# EAGLE design power1pDINline4 (EAGLE 9.3.1)
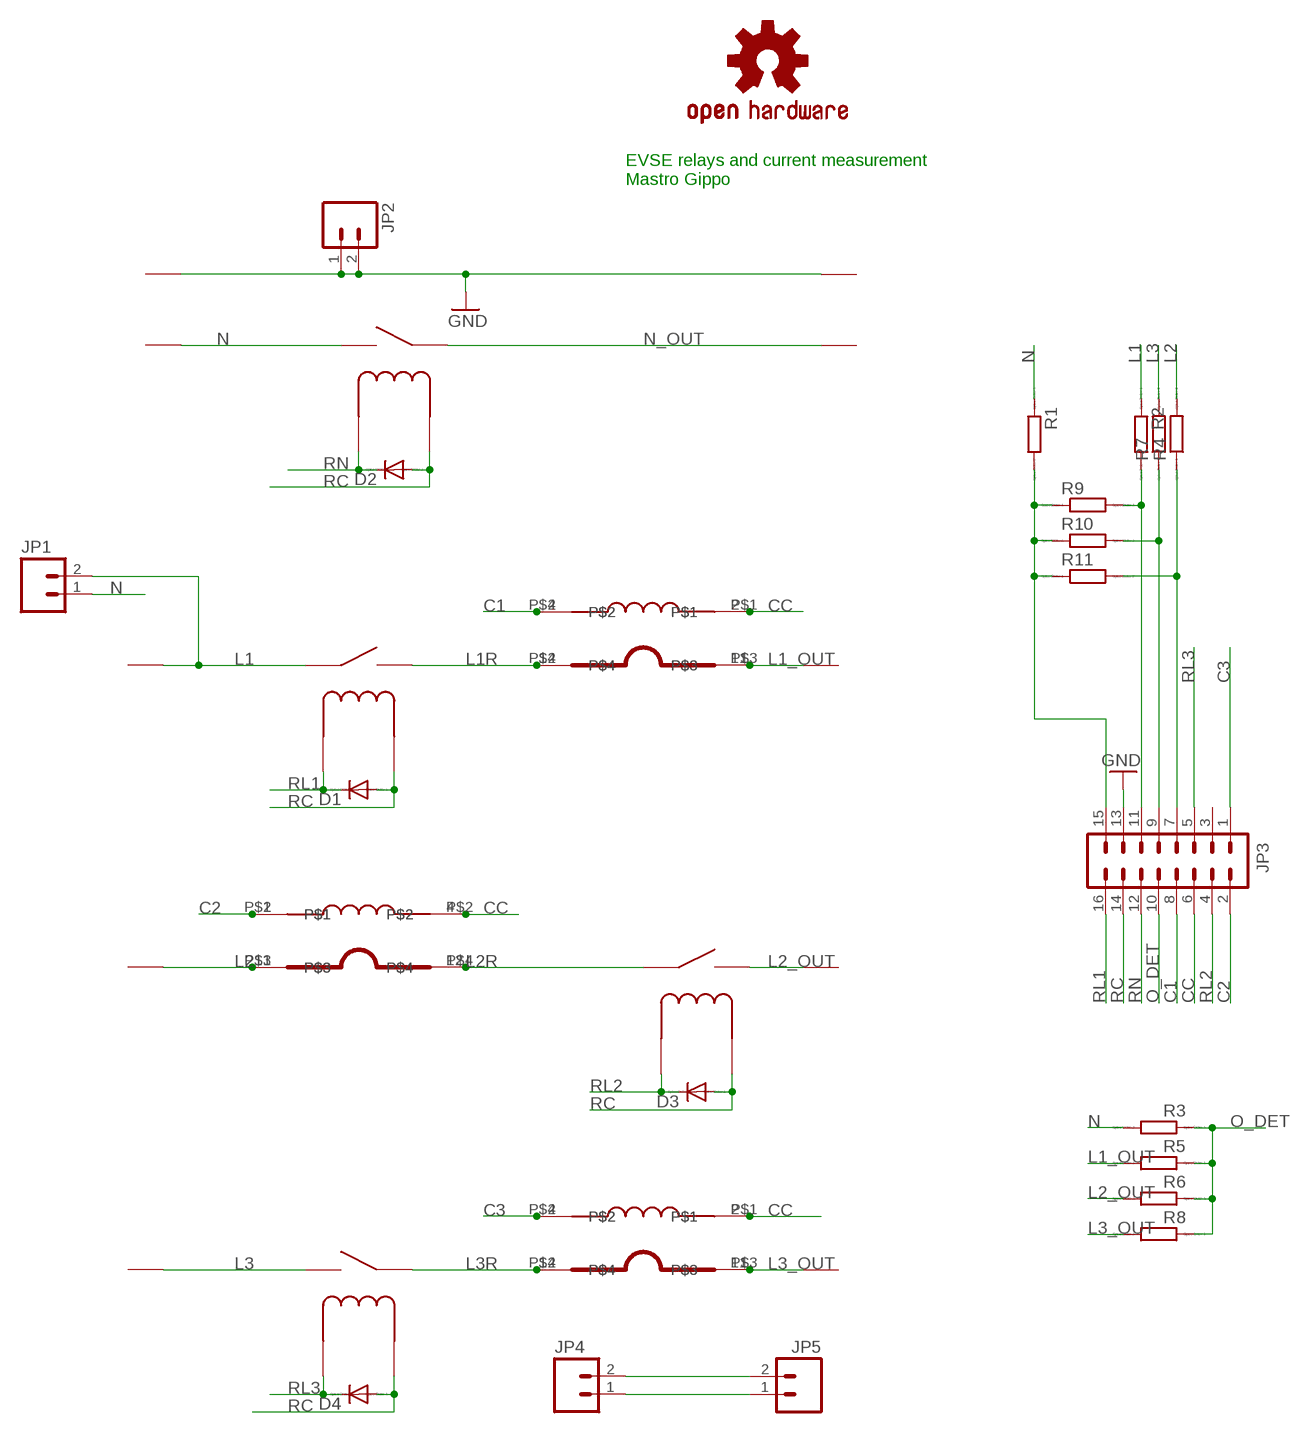
[diagram p0: schematic, sheet 1]

## Parts
D1  DIODE-DO-214AC  [DO-214AC]
D2  DIODE-DO-214AC  [DO-214AC]
D3  DIODE-DO-214AC  [DO-214AC]
D4  DIODE-DO-214AC  [DO-214AC]
JP1  M025MM  [SCREWTERMINAL-5MM-2]
JP2  M025MM  [SCREWTERMINAL-5MM-2]
JP3  M08X2  [2X8]
JP4  M025MM  [SCREWTERMINAL-5MM-2]
JP5  M025MM  [SCREWTERMINAL-5MM-2]
R1  R-EU_0207_10  [0207/10]
R2  R-EU_0207_10  [0207/10]
R3  R-EU_0207_10  [0207/10]
R4  R-EU_0207_10  [0207/10]
R5  R-EU_0207_10  [0207/10]
R6  R-EU_0207_10  [0207/10]
R7  R-EU_0207_10  [0207/10]
R8  R-EU_0207_10  [0207/10]
R9  R-EU_M0805  [M0805]
R10  R-EU_M0805  [M0805]
R11  R-EU_M0805  [M0805]
U$1  T9S  [T9SSOLAR]
U$2  T9S  [T9SSOLAR]
U$3  PLH5_1  [PLH5]
U$4  PLH5_1  [PLH5]
U$5  PLH5_1  [PLH5]
U$6  PLH5_1  [PLH5]
U$7  PLH5_1  [PLH5]
U$8  CSE187L  [CSE187L]
U$9  PLH5_1  [PLH5]
U$10  PLH5_1  [PLH5]
U$11  PLH5_1  [PLH5]
U$12  T9S  [T9SSOLAR]
U$14  PLH5_1  [PLH5]
U$15  PLH5_1  [PLH5]
U$16  PB0025NL  [PILSA_CURR_MIN]
U$17  T9S  [T9SSOLAR]
U$18  PB0025NL  [PILSA_CURR_MIN]
U$19  PB0025NL  [PILSA_CURR_MIN]
U$20  CSE187L  [CSE187L]
U$21  OSHW-LOGOL  [OSHW-LOGO-L]
U$22  CSE187L  [CSE187L]

## Nets
C1: JP3.8 U$8.P$2 U$18.4
C2: JP3.2 U$19.2 U$22.P$1
C3: JP3.1 U$16.4 U$20.P$2
CC: JP3.6 U$8.P$1 U$16.2 U$18.2 U$19.4 U$20.P$1 U$22.P$2
GND: JP2.1 JP2.2 JP3.13 U$9.P$1 U$9.P$2 U$10.P$1 U$10.P$2
L1: JP1.2 R2.1 U$2.TR1(TR) U$2.TR2(TR) U$4.P$1 U$4.P$2
L1_OUT: R5.2 U$6.P$1 U$6.P$2 U$8.P$3 U$18.11
L1R: U$2.TL1(TL) U$2.TL2(TL) U$8.P$4 U$18.12
L2: R4.2 U$7.P$1 U$7.P$2 U$19.11 U$22.P$3
L2_OUT: R6.2 U$11.P$1 U$11.P$2 U$12.TL1(TL) U$12.TL2(TL)
L2R: U$12.TR1(TR) U$12.TR2(TR) U$19.12 U$22.P$4
L3: R7.2 U$14.P$1 U$14.P$2 U$17.TL1(TL) U$17.TL2(TL)
L3_OUT: R8.2 U$15.P$1 U$15.P$2 U$16.11 U$20.P$3
L3R: U$16.12 U$17.TR1(TR) U$17.TR2(TR) U$20.P$4
N: JP1.1 R1.1 R3.2 U$1.TL1(TL) U$1.TL2(TL) U$3.P$1 U$3.P$2
N$2: JP3.9 R7.1 R10.2
N$4: JP4.1 JP5.1
N$5: JP4.2 JP5.2
N$6: JP3.11 R2.2 R9.2
N$8: JP3.15 R1.2 R9.1 R10.1 R11.1
N$13: JP3.7 R4.1 R11.2
N_OUT: U$1.TR1(TR) U$1.TR2(TR) U$5.P$1 U$5.P$2
O_DET: JP3.10 R3.1 R5.1 R6.1 R8.1
RC: D1.A D2.A D3.A D4.A JP3.14 U$1.C2 U$2.C1 U$12.C1 U$17.C2
RL1: D1.C JP3.16 U$2.C2
RL2: D3.C JP3.4 U$12.C2
RL3: D4.C JP3.5 U$17.C1
RN: D2.C JP3.12 U$1.C1
Unconnected: JP3.3

## Notes on the sheet
- EVSE relays and current measurement
  Mastro Gippo

## Library data of the parts
D1-D4 = diode:DIODE-: DIODE
JP1 JP2 JP4 JP5 = SparkFun-Connectors:M02: Standard 2-pin 0.1" header. Use with - straight break away headers ( PRT-00116) - right angle break away headers (PRT-00553) - swiss pins (PRT-00743) - machine pins (PRT-00117) - female headers (PRT-00115) Molex polarized connector foot print use with: PRT-08233 with associated crimp pins and housings. 2.54_SCREWTERM for use with PRT-10571. 3.5mm Screw Terminal footprints for PRT-08084 5mm Screw Terminal footprints for use with PRT-08432; STOREFRONT_ID: PRT-08432
JP3 = SparkFun-Connectors:M08X2: .1" headers, two rows of 8 each
R1-R11 = resistor:R-EU_: RESISTOR, European symbol; SPICEPREFIX: R
U$1 U$2 U$12 U$17 = evse:T9S
U$3-U$7 U$9-U$11 U$14 U$15 = evse:PLH5_1
U$8 U$20 U$22 = evse:CSE187L
U$16 U$18 U$19 = evse:PB0025NL
U$21 = mastrogippo:OSHW-LOGO: Open Source Hardware Logo This logo indicates the piece of hardware it is found on incorporates a OSHW license and/or adheres to the definition of open source hardware found here: http://freedomdefined.org/OSHW

## Board
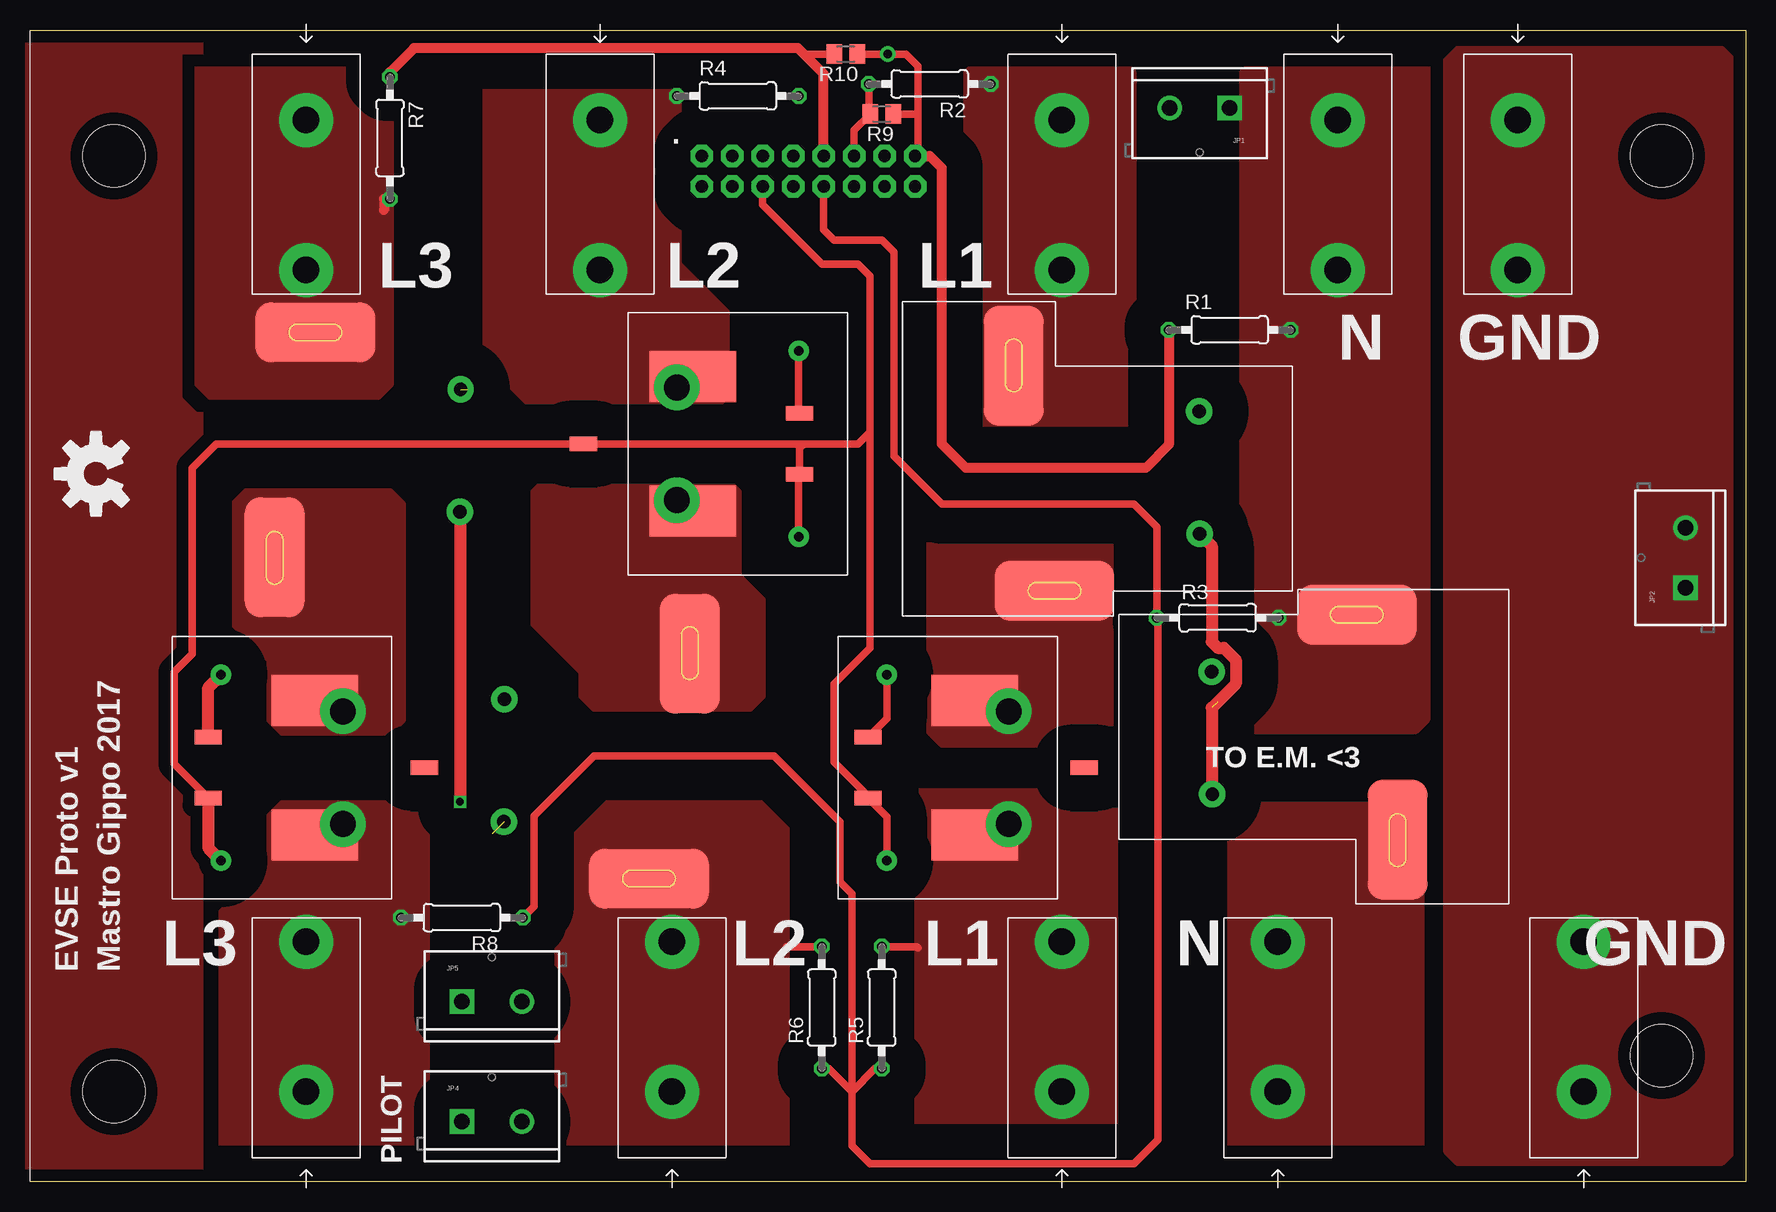
[diagram p1: board, top side]
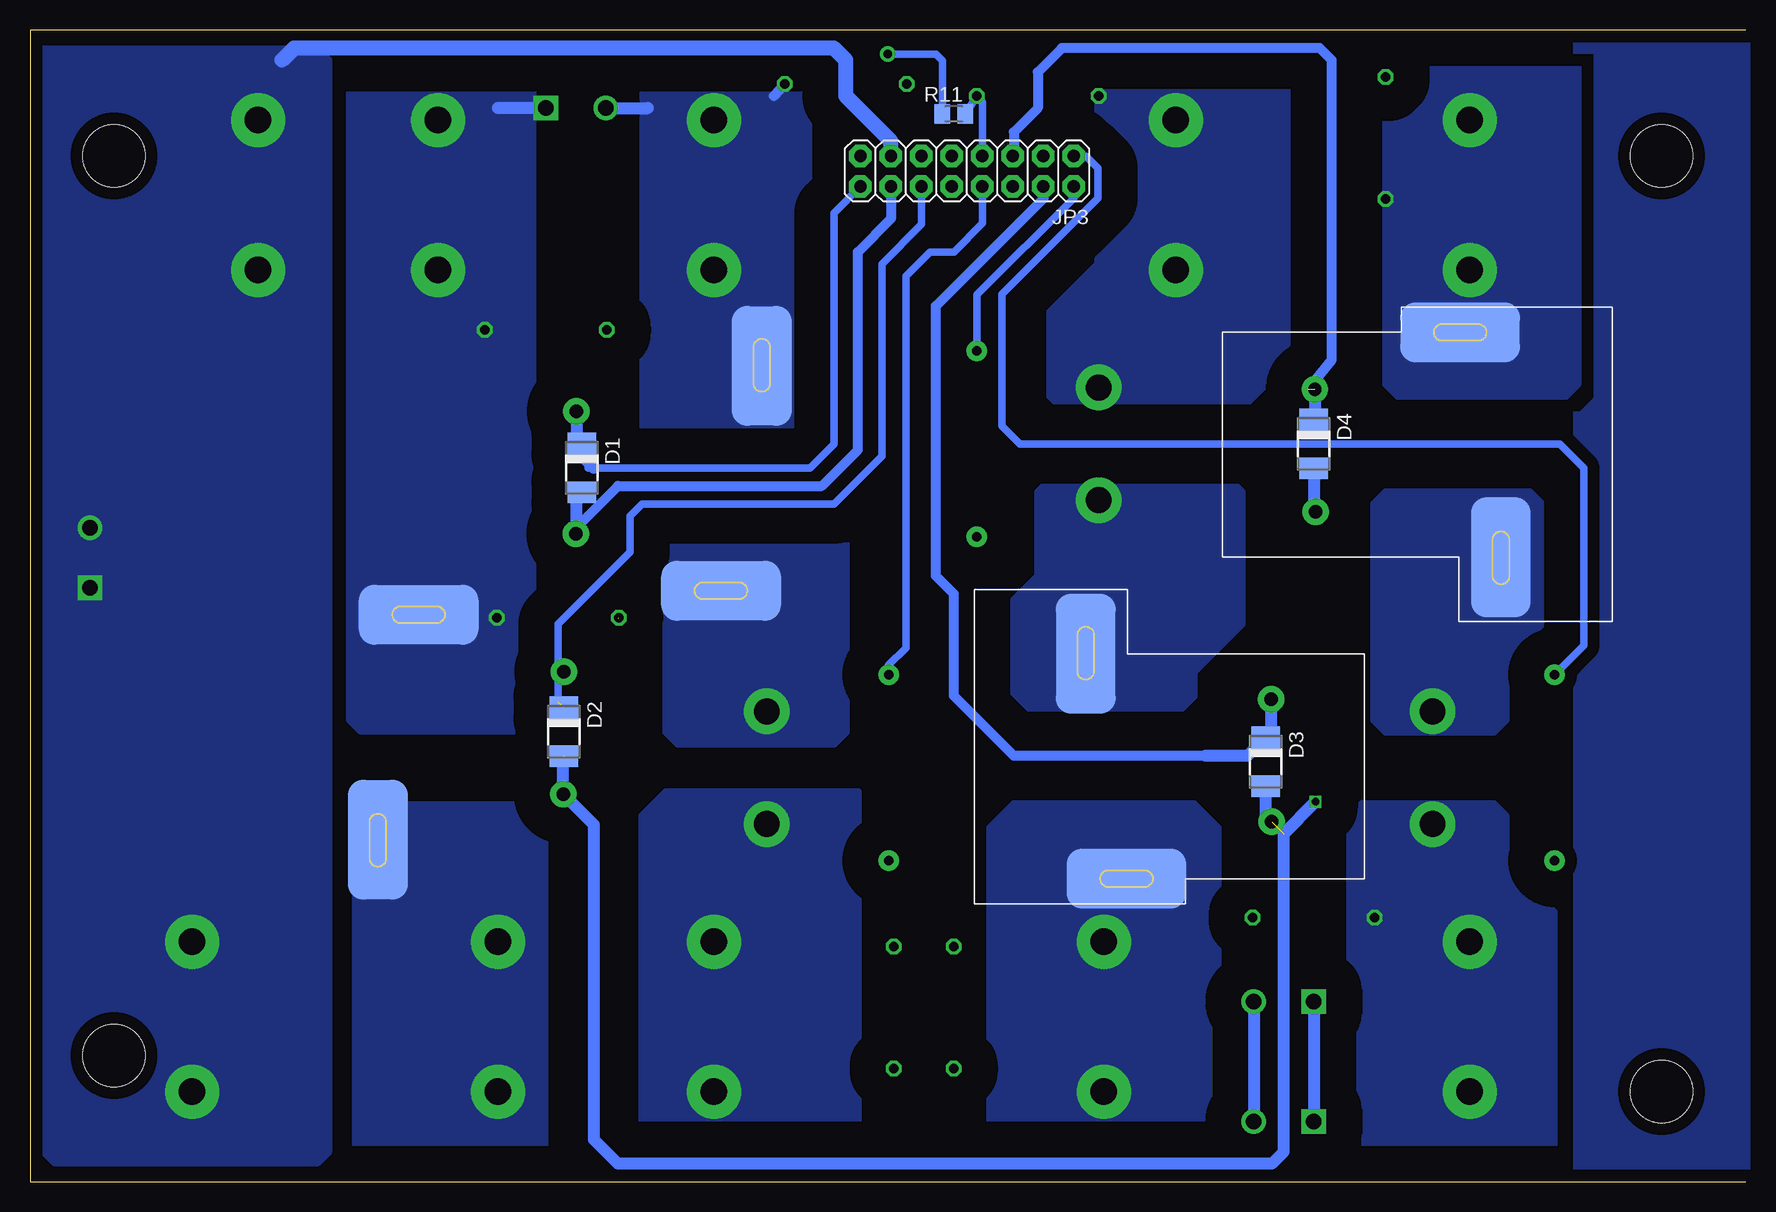
[diagram p2: board, bottom side, seen from below]

Size 143 x 96 mm. Coordinates in mm from the lower left corner, seen from the top.
Outline: 0,0 143,0 143,96 0,96
Copper layers (1*16): Top 0.035mm / dielectric 1.5mm / Bottom 0.035mm
Design rules "default": minimum track width 10mil, minimum drill 24mil, track to track 8mil, track to pad 8mil, pad to pad 8mil, via to via 8mil, smd to smd 8mil, copper to edge 40mil, drill to drill 8mil, minimum pad ring 10mil, minimum via ring 8mil, stop-mask expansion 4mil, vias tented up to drill 0mil, thermal gap 10mil
Holes 5.2 mm at 136,85.5 136,10.5 7,85.5 7,7.5

### Footprints (pad centres in the part's own frame; a part is rotated, then mirrored left to right if it is on the bottom)
DO-214AC = smd 1.8 x 2.4: A 2.025,0; C -2.025,0
SCREWTERMINAL-5MM-2 = drill 1.3 pad 2.032 square: 1 0,0 | drill 1.3 pad 2.032: 2 5,0
2X8 = drill 1.016 pad 1.88 octagon: 1 0,0; 2 0,2.54; 3 2.54,0; 4 2.54,2.54; 5 5.08,0; 6 5.08,2.54; 7 7.62,0; 8 7.62,2.54; 9 10.16,0; 10 10.16,2.54; 11 12.7,0; 12 12.7,2.54; 13 15.24,0; 14 15.24,2.54; 15 17.78,0; 16 17.78,2.54
0207/10 = drill 0.813 octagon: 1 -5.08,0; 2 5.08,0
M0805 = smd 1.3 x 1.6: 1 -0.95,0; 2 0.95,0
T9SSOLAR = drill 1.1 pad 2.184: C1 -14,-15.5; C2 -3.8,-15.45 | smd 5 x 10: TL1 -18.75,-3.4 | smd 5 x 10 bottom: TL2 -18.75,-3.4 | smd 10 x 5: TR1 0,0 | smd 10 x 5 bottom: TR2 0,0
PLH5 = drill 2.2 pad 4.5: P$1 0,0; P$2 0,12.5
CSE187L = drill 0.762 pad 1.676: P$1 -7.747,5.08; P$2 7.747,5.08 | drill 2.159 pad 3.81: P$3 -4.699,-5.08; P$4 4.699,-5.08
PILSA_CURR_MIN = smd 2.286 x 1.194: 1 -8.89,0; 2 9.144,2.54; 4 9.144,-2.54 | smd 7.239 x 4.242: 11 0.254,5.588; 12 0.254,-5.588

### Placement (x,y rotation side)
D1  97,59.5 270 bottom
D2  98.5,37.5 270 bottom
D3  40,35 270 bottom
D4  36,61.5 270 bottom
JP1  100,89.5 180 top
JP2  138,49.5 90 top
JP3  56,85.5 180 bottom
JP4  36,5 0 top
JP5  36,15 0 top
R1  100,71 180 top
R2  75,91.5 180 top
R3  99,47 0 top
R4  59,90.5 180 top
R5  71,14.5 90 top
R6  66,14.5 90 top
R7  30,87 270 top
R8  36,22 180 top
R9  71,89 180 top
R10  68,94 180 top
R11  66,89 0 bottom
U$1  114,28.5 270 top
U$2  82,68 90 top
U$3  109,88.5 180 top
U$4  86,88.5 180 top
U$5  104,7.5 0 top
U$6  86,7.5 0 top
U$7  47.5,88.5 180 top
U$8  76.5,34.5 90 top
U$9  129.5,7.5 0 top
U$10  124,88.5 180 top
U$11  53.5,7.5 0 top
U$12  55,44 90 bottom
U$14  23,88.5 180 top
U$15  23,7.5 0 top
U$16  24,34.5 180 top
U$17  20.39,52.04 270 bottom
U$18  79,34.5 180 top
U$19  55,61.5 0 top
U$20  21,34.5 90 top
U$21  5.5,59 90 top
U$22  59,61.5 270 top

### Tracks (layer width: path | path; a pad name or v marks a point on that pad's centre or on a via)
C1
  Top 0.61: U$8.P$2 71.42,38.6 U$18.4
  Bottom 0.61: U$8.P$2 71.42,43.08 70,44.5 70,75.5 68,77.5 66,77.5 63.62,79.88 JP3.8
C2
  Top 0.61: U$22.P$1 64.08,64.1 U$19.2
  Bottom 0.61: JP3.2 56,82 64.08,73.92 U$22.P$1
C3
  Top 1.016: U$16.4 14.86,41.18 U$20.P$2
  Bottom 0.61: JP3.1 55,85.5 54,84.5 54,82 62,74 62,63 60.5,61.5 15.5,61.5 13.5,59.5 13.5,44.67 U$20.P$2
CC
  Top 0.61: JP3.6 61.08,81.42 66,76.5 69,76.5 70,75.5 70,62.5 | 70,62.5 70,44.5 67,41.5 67,35 70,32 69.82,32 U$18.2 71.42,30.4 U$8.P$1 | 64.5,61.5 69,61.5 70,62.5 | 64.5,61.5 15.5,61.5 13.5,59.5 13.5,44 12,42.5 12,34.82 U$16.2 | U$22.P$2 64.08,58.9 U$19.4 64.14,61.14 64.5,61.5
  Top 1.016: U$16.2 14.86,27.82 U$20.P$1
  Bottom 0.61: 16,26.5 16,26.67 U$20.P$1
GND
  Bottom 1.27: JP3.13 71.24,86.74 75,90.5 75,93.5 76,94.5 121,94.5 122,93.5
  pour Top (isolate 1, rank 2, no thermals): 141,94.5 142,93.5 142,2.5 141,1.5 119,1.5 118,2.5 118,93.5 119,94.5
  pour Bottom (isolate 1, rank 2, no thermals): 119,94.5 142,94.5 142,2.5 141,1.5 119,1.5 118,2.5 118,93.5
L1
  Bottom 0.813: R2.1 81,90.5
  Bottom 1.016: JP1.2 91.5,89.5
  pour Top (isolate 3, no thermals): 79,93.5 91,93.5 92,92.5 92,62.5 91,61.5 79,61.5 78,62.5 78,92.5
  pour Bottom (isolate 3, no thermals): 79,93.5 91,93.5 92,92.5 92,62.5 91,61.5 79,61.5 78,62.5 78,92.5
L1_OUT
  Top 0.61: R5.2 73.92,19.58 74,19.5
  pour Top (isolate 3, no thermals): 74,32.5 74,3.5 75,2.5 91,2.5 92,3.5 92,30.5 90,32.5
  pour Bottom (isolate 3, no thermals): 74,32.5 74,3.5 75,2.5 91,2.5 92,3.5 92,30.5 90,32.5
L1R
  pour Top (isolate 3, no thermals): 89,55 90,54 90,37.5 89,36.5 76,36.5 75,37.5 75,54 76,55
  pour Bottom (isolate 3, no thermals): 89,55 90,54 90,37.5 89,36.5 76,36.5 75,37.5 75,54 76,55
L2
  pour Top (isolate 3, no thermals): 41,94.5 38,91.5 38,68.5 42,64.5 57,64.5 58,65.5 58,72.5 54,76.5 54,92.5 52,94.5
  pour Bottom (isolate 3, no thermals): 40,94.5 37,91.5 37,69.5 42,64.5 57,64.5 58,65.5 58,72.5 54,76.5 54,92.5 52,94.5
L2_OUT
  Top 0.61: R6.2 63.08,19.58 63,19.5
  pour Top (isolate 3, no thermals): 46,31.5 44,29.5 44,2.5 45,1.5 62,1.5 63,2.5 63,29.5 61,31.5
  pour Bottom (isolate 3, no thermals): 46,31.5 44,29.5 44,2.5 45,1.5 62,1.5 63,2.5 63,29.5 61,31.5
L2R
  pour Top (isolate 3, no thermals): 58,58.5 59,57.5 59,50.5 61,48.5 61,40.5 60,39.5 47,39.5 46,40.5 46,42.5 42,46.5 42,57.5 43,58.5
  pour Bottom (isolate 3, no thermals): 58,58.5 59,57.5 59,50.5 61,48.5 61,40.5 60,39.5 47,39.5 46,40.5 46,42.5 42,46.5 42,57.5 43,58.5
L3
  Top 0.813: R7.2 29.5,81.92 29.5,81
  pour Top (isolate 3, no thermals): 30,94.5 30,66.5 29,65.5 15,65.5 14,66.5 14,93.5 15,94.5
  pour Bottom (isolate 3, no thermals): 30,94.5 30,66.5 29,65.5 15,65.5 14,66.5 14,93.5 15,94.5
L3_OUT
  pour Top (isolate 3, no thermals): 21,31.5 20,30.5 20,26.5 16,22.5 16,2.5 17,1.5 32,1.5 33,2.5 33,30.5 32,31.5
  pour Bottom (isolate 3, no thermals): 21,31.5 20,30.5 20,26.5 16,22.5 16,2.5 17,1.5 32,1.5 33,2.5 33,30.5 32,31.5
L3R
  pour Top (isolate 3, no thermals): 18,57.5 17,56.5 17,46.5 20,43.5 20,38.5 21,37.5 30,37.5 31,38.5 31,56.5 30,57.5
  pour Bottom (isolate 3, no thermals): 18,57.5 17,56.5 17,46.5 20,43.5 20,38.5 21,37.5 30,37.5 31,38.5 31,56.5 30,57.5
N
  Bottom 1.016: JP1.1 104,89.5
  pour Top (isolate 3, no thermals): 102,93.5 116.5,93.5 116.5,38.5 115.5,37.5 102,37.5 101,38.5 101,92.5
  pour Bottom (isolate 3, no thermals): 104,93.5 116.5,93.5 116.5,38.5 115.5,37.5 102,37.5 101,38.5 101,92.5
N$2
  Top 0.61: R10.2 64.5,94
  Top 0.813: JP3.9 66.16,92.34 64.5,94 64,94.5 32,94.5 30,92.5 R7.1
N$3
  pour Bottom (isolate 1, rank 2): 0,95.5 14,95.5 14,0.5 0,0.5
  pour Top (isolate 1, rank 2): 0,95.5 14,95.5 14,0.5 0,0.5
N$4
  Bottom 1.016: JP5.1 JP4.1
N$5
  Bottom 1.016: JP5.2 JP4.2
N$6
  Top 0.61: R2.2 69.92,89.13 R9.2 68.7,87.65 JP3.11
N$8  (via drill 0.7 pad 1.27)
  Top 0.61: R10.1 v71.5,94 73,94 74,93 74,89 | 74,89 74,85.72 JP3.15 | R9.1 74,89
  Top 0.813: JP3.15 75,85.5 76,84.5 76,61.5 78,59.5 93,59.5 94.92,61.42 R1.2
  Bottom 0.61: R11.1 66.95,93.45 67.5,94 v71.5,94
N$13
  Bottom 0.61: R11.2 R4.1 63.62,89.96 JP3.7
N_OUT
  pour Top (isolate 3, no thermals): 116,30.5 116,2.5 115,1.5 101,1.5 100,2.5 100,30.5 101,31.5 115,31.5
  pour Bottom (isolate 3, no thermals): 116,30.5 116,2.5 115,1.5 101,1.5 100,2.5 100,30.5 101,31.5 115,31.5
O_DET  (1 unrouted)
  Top 0.61: 94,47 94,3.5 92,1.5 70,1.5 68.5,3 68.5,7.5 | JP3.10 66.16,79.34 67,78.5 71,78.5 72,77.5 72,60.5 76,56.5 92,56.5 93.92,54.58 R3.1 | R8.1 42,22.92 42,30.5 47,35.5 62,35.5 67.5,30 67.5,25 68.5,24 68.5,7.5 | R6.1 66.58,9.42 68.5,7.5 | R5.1 70.42,9.42 68.5,7.5
RC  (via drill 0.6)  (2 unrouted)
  Top 1.016: U$2.C1 98.5,53 98.5,45 99,44.5 99.5,44.5 100.5,43.5 100.5,41.5 98.5,39.5 98.5,32.35 U$1.C2 | U$17.C2 v35.84,31.66
  Bottom 0.813: JP3.14 71.24,80.26 74,77.5 74,61 77,58 94,58 97.5,54.5
  Bottom 1.016: v35.84,31.66 38.5,29 38.5,2.5 39.5,1.5 94,1.5 96,3.5 96,29.75 U$1.C2 98.55,34.95 98.5,35 98.5,35.5 | 97.5,54.5 U$2.C1 97.5,56.98 D1.A | U$12.C1 40,30.5 D3.A 40,33 | D4.A 36,56 U$17.C2
RL1
  Bottom 0.61: 96.5,59.5 96,59.5 78,59.5 76,61.5 76,80.74 JP3.16
  Bottom 1.016: 96,59.5 97.5,61 97.5,61.5 97.03,61.5 D1.C 97.45,61.98 U$2.C2
RL2
  Bottom 0.813: 45,35.5 61,35.5 66,40.5 66,49 67.5,50.5 67.5,73 58.5,82 58.5,82.92 JP3.4
  Bottom 1.016: U$12.C2 39.55,37.48 D3.C 41.52,35.5 45,35.5
RL3  (1 unrouted)
  Bottom 0.813: 36.46,66.04 34.5,68.5 34.5,93.5 35.5,94.5 57,94.5 59,92.5 59,89.5 61,87.5 61,85.58 JP3.5
  Bottom 1.016: U$17.C1 35.89,63.63 D4.C
RN  (1 unrouted)
  Bottom 0.61: JP3.12 68.7,79.8 72,76.5 72,60.5 76,56.5 92,56.5 93,55.5 93,52.5 99,46.5 99,42.5 99,40
  Bottom 1.016: U$1.C1 99,42.5

### Text on the board
tNames: L3 | L2 | L1 | N | GND | TO E.M. <3 | L3 | L2 | L1 | N | GND | EVSE Proto v1 | Mastro Gippo 2017 | PILOT
tSilk: .